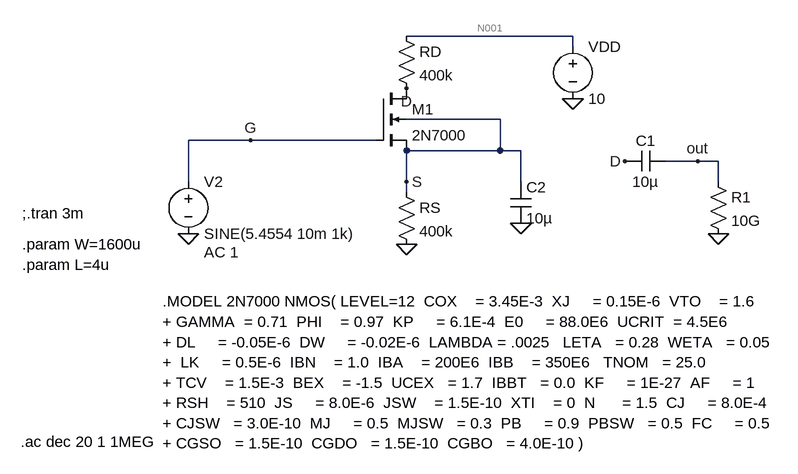
[diagram p0: schematic 2n7000_ekv_VT_KN.asc]
2n7000_ekv_VT_KN.asc, the LTspice schematic file:
Version 4
SHEET 1 2092 1428
WIRE 640 80 384 80
WIRE 640 96 640 80
WIRE 528 208 384 208
WIRE 144 240 48 240
WIRE 336 240 144 240
WIRE 528 256 528 208
WIRE 528 256 384 256
WIRE 560 256 528 256
WIRE 832 272 784 272
WIRE 864 272 832 272
WIRE 48 304 48 240
WIRE 384 304 384 256
WIRE 560 304 560 256
WIRE 864 304 864 272
WIRE 384 320 384 304
FLAG 640 176 0
FLAG 384 400 0
FLAG 560 368 0
FLAG 864 384 0
FLAG 384 160 D
FLAG 720 272 D
FLAG 48 384 0
FLAG 832 272 out
FLAG 144 240 G
FLAG 384 304 S
SYMBOL nmos4 336 160 R0
SYMATTR InstName M1
SYMATTR Value2 l={L} w={W}
SYMATTR Value 2N7000
SYMBOL voltage 640 80 R0
WINDOW 123 0 0 Left 2
WINDOW 39 0 0 Left 2
SYMATTR InstName VDD
SYMATTR Value 10
SYMBOL res 368 64 R0
SYMATTR InstName RD
SYMATTR Value 400k
SYMBOL voltage 48 288 R0
WINDOW 123 24 124 Left 2
WINDOW 39 0 0 Left 0
SYMATTR InstName V2
SYMATTR Value SINE(5.4554 10m 1k)
SYMATTR Value2 AC 1
SYMBOL res 368 304 R0
SYMATTR InstName RS
SYMATTR Value 400k
SYMBOL cap 784 256 R90
WINDOW 0 0 32 VBottom 2
WINDOW 3 32 32 VTop 2
SYMATTR InstName C1
SYMATTR Value 10µ
SYMBOL cap 544 304 R0
SYMATTR InstName C2
SYMATTR Value 10µ
SYMBOL res 848 288 R0
SYMATTR InstName R1
SYMATTR Value 10G
TEXT 8 488 Left 2 !.MODEL 2N7000 NMOS( LEVEL=12  COX    = 3.45E-3  XJ     = 0.15E-6  VTO    = 1.6\n+ GAMMA  = 0.71  PHI    = 0.97  KP     = 6.1E-4  E0     = 88.0E6  UCRIT  = 4.5E6 \n+ DL     = -0.05E-6  DW     = -0.02E-6  LAMBDA = .0025   LETA   = 0.28  WETA   = 0.05 \n+  LK     = 0.5E-6  IBN    = 1.0  IBA    = 200E6  IBB    = 350E6   TNOM   = 25.0 \n+ TCV    = 1.5E-3  BEX    = -1.5  UCEX   = 1.7  IBBT   = 0.0  KF     = 1E-27  AF     = 1 \n+ RSH    = 510  JS     = 8.0E-6  JSW    = 1.5E-10  XTI    = 0  N      = 1.5  CJ     = 8.0E-4 \n+ CJSW   = 3.0E-10  MJ     = 0.5  MJSW   = 0.3  PB     = 0.9  PBSW   = 0.5  FC     = 0.5 \n+ CGSO   = 1.5E-10  CGDO   = 1.5E-10  CGBO   = 4.0E-10 )
TEXT -208 352 Left 2 !;.tran 3m
TEXT -208 400 Left 2 !.param W=1600u\n.param L=4u
TEXT -210 704 Left 2 !.ac dec 20 1 1MEG

The netlist it stands for:
* 2n7000_ekv_VT_KN.asc
M1 D G S S 2N7000 l={L} w={W}
VDD N001 0 10
RD N001 D 400k
V2 G 0 SINE(5.4554 10m 1k) AC 1
RS S 0 400k
C1 out D 10µ
C2 S 0 10µ
R1 out 0 10G
.model NMOS NMOS
.model PMOS PMOS
.lib standard.mos
.MODEL 2N7000 NMOS( LEVEL=12  COX    = 3.45E-3  XJ     = 0.15E-6  VTO    = 1.6
+ GAMMA  = 0.71  PHI    = 0.97  KP     = 6.1E-4  E0     = 88.0E6  UCRIT  = 4.5E6
+ DL     = -0.05E-6  DW     = -0.02E-6  LAMBDA = .0025   LETA   = 0.28  WETA   = 0.05
+  LK     = 0.5E-6  IBN    = 1.0  IBA    = 200E6  IBB    = 350E6   TNOM   = 25.0
+ TCV    = 1.5E-3  BEX    = -1.5  UCEX   = 1.7  IBBT   = 0.0  KF     = 1E-27  AF     = 1
+ RSH    = 510  JS     = 8.0E-6  JSW    = 1.5E-10  XTI    = 0  N      = 1.5  CJ     = 8.0E-4
+ CJSW   = 3.0E-10  MJ     = 0.5  MJSW   = 0.3  PB     = 0.9  PBSW   = 0.5  FC     = 0.5
+ CGSO   = 1.5E-10  CGDO   = 1.5E-10  CGBO   = 4.0E-10 )
;.tran 3m
.param W=1600u
.param L=4u
.ac dec 20 1 1MEG
.backanno
.end

* Results of the author's LTspice run, read from the files saved beside the schematic
* Operating Point, zero values left out:
*   V(d) = 6 V
*   V(g) = 5.455 V
*   V(s) = 4 V
*   V(n001) = 10 V
*   V(out) = 600 nV
*   Id(M1) = 10 µA
*   Ib(M1) = -88.85 pA
*   Is(M1) = -10 µA
*   I(Rs) = 10 µA
*   I(Rd) = 10 µA
*   I(Vdd) = -10 µA
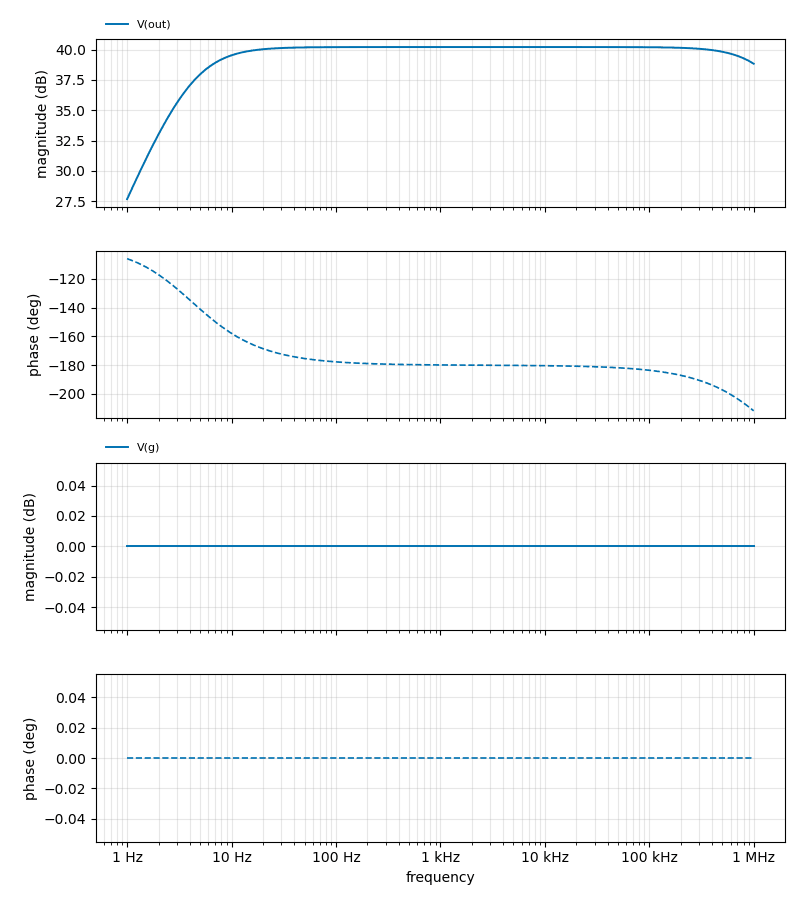
[diagram p1: AC Analysis of 2n7000_ekv_VT_KN.asc, plotted from the saved traces]
* AC Analysis, 1 run:
*   V(out): 27.67 dB at 1 Hz, 38.83 dB at 1 MHz, peak 40.20 dB at 2.512 kHz, 3 dB below the peak at 4.121 Hz
*   V(g): 0.00 dB at 1 Hz, 0.00 dB at 1 MHz, peak 0.00 dB at 1 Hz